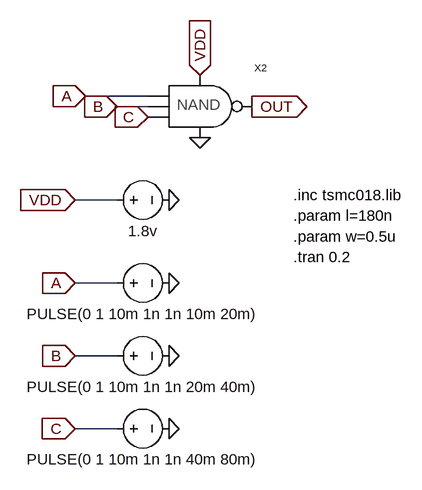
[diagram p0: schematic NAND3sim.asc]
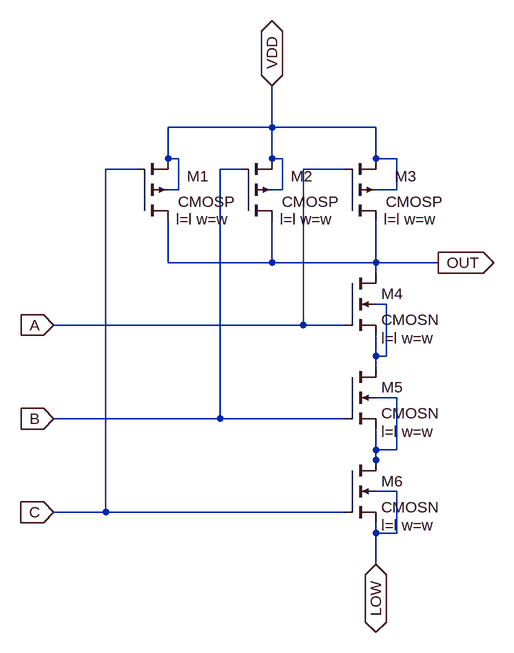
[diagram p1: sub-circuit nand3.asc]
NAND3sim.asc, the LTspice schematic file:
Version 4
SHEET 1 880 712
WIRE 112 128 16 128
WIRE 112 144 64 144
WIRE 64 288 0 288
WIRE 64 416 0 416
WIRE 64 528 0 528
WIRE 64 640 0 640
FLAG 16 128 A
IOPIN 16 128 In
FLAG 64 144 B
IOPIN 64 144 In
FLAG 112 160 C
IOPIN 112 160 In
FLAG 192 96 VDD
IOPIN 192 96 In
FLAG 272 144 OUT
IOPIN 272 144 Out
FLAG 192 192 0
FLAG 144 288 0
FLAG 144 416 0
FLAG 144 528 0
FLAG 144 640 0
FLAG 0 288 VDD
IOPIN 0 288 In
FLAG 0 416 A
IOPIN 0 416 In
FLAG 0 528 B
IOPIN 0 528 In
FLAG 0 640 C
IOPIN 0 640 In
SYMBOL voltage 48 288 R270
WINDOW 0 32 56 Invisible 2
WINDOW 3 -32 56 VBottom 2
SYMATTR InstName V1
SYMATTR Value 1.8v
SYMBOL voltage 48 416 R270
WINDOW 0 32 56 Invisible 2
WINDOW 3 -32 56 VBottom 2
WINDOW 123 0 0 Left 0
WINDOW 39 0 0 Left 0
SYMATTR InstName V2
SYMATTR Value PULSE(0 1 10m 1n 1n 10m 20m)
SYMBOL voltage 48 528 R270
WINDOW 0 32 56 Invisible 2
WINDOW 3 -32 56 VBottom 2
WINDOW 123 0 0 Left 0
WINDOW 39 0 0 Left 0
SYMATTR InstName V3
SYMATTR Value PULSE(0 1 10m 1n 1n 20m 40m)
SYMBOL voltage 48 640 R270
WINDOW 0 32 56 Invisible 2
WINDOW 3 -32 56 VBottom 2
WINDOW 123 0 0 Left 0
WINDOW 39 0 0 Left 0
SYMATTR InstName V4
SYMATTR Value PULSE(0 1 10m 1n 1n 40m 80m)
SYMBOL NAND3 192 368 R0
SYMATTR InstName X2
TEXT 336 280 Left 2 !.inc tsmc018.lib
TEXT 336 312 Left 2 !.param l=180n
TEXT 336 344 Left 2 !.param w=0.5u
TEXT 336 376 Left 2 !.tran 0.2

nand3.asc, the sub-circuit schematic file:
Version 4
SHEET 1 1216 840
WIRE 352 -48 352 -112
WIRE 352 -48 192 -48
WIRE 512 -48 352 -48
WIRE 192 0 192 -48
WIRE 208 0 192 0
WIRE 352 0 352 -48
WIRE 368 0 352 0
WIRE 512 0 512 -48
WIRE 544 0 512 0
WIRE 144 16 96 16
WIRE 304 16 272 16
WIRE 464 16 400 16
WIRE 208 48 208 0
WIRE 208 48 192 48
WIRE 368 48 368 0
WIRE 368 48 352 48
WIRE 544 48 544 0
WIRE 544 48 512 48
WIRE 192 160 192 96
WIRE 352 160 352 96
WIRE 352 160 192 160
WIRE 512 160 512 96
WIRE 512 160 352 160
WIRE 608 160 512 160
WIRE 512 176 512 160
WIRE 528 224 512 224
WIRE 400 256 400 16
WIRE 400 256 16 256
WIRE 464 256 400 256
WIRE 512 304 512 272
WIRE 528 304 528 224
WIRE 528 304 512 304
WIRE 512 320 512 304
WIRE 544 368 512 368
WIRE 272 400 272 16
WIRE 272 400 16 400
WIRE 464 400 272 400
WIRE 512 448 512 416
WIRE 544 448 544 368
WIRE 544 448 512 448
WIRE 512 464 512 448
WIRE 512 480 512 464
WIRE 544 512 512 512
WIRE 96 544 96 16
WIRE 96 544 16 544
WIRE 464 544 96 544
WIRE 512 576 512 560
WIRE 544 576 544 512
WIRE 544 576 512 576
WIRE 512 624 512 576
FLAG 352 -112 VDD
IOPIN 352 -112 BiDir
FLAG 16 256 A
IOPIN 16 256 In
FLAG 16 400 B
IOPIN 16 400 In
FLAG 16 544 C
IOPIN 16 544 In
FLAG 608 160 OUT
IOPIN 608 160 Out
FLAG 512 624 LOW
IOPIN 512 624 BiDir
SYMBOL nmos4 464 176 R0
WINDOW 123 56 100 Left 2
SYMATTR Value2 l=l w=w
SYMATTR InstName M4
SYMATTR Value CMOSN
SYMBOL nmos4 464 320 R0
WINDOW 123 56 100 Left 2
SYMATTR Value2 l=l w=w
SYMATTR InstName M5
SYMATTR Value CMOSN
SYMBOL nmos4 464 464 R0
WINDOW 123 56 100 Left 2
SYMATTR Value2 l=l w=w
SYMATTR InstName M6
SYMATTR Value CMOSN
SYMBOL pmos4 144 96 M180
WINDOW 123 60 3 Left 2
WINDOW 0 77 69 Left 2
WINDOW 3 63 30 Left 2
SYMATTR Value2 l=l w=w
SYMATTR InstName M1
SYMATTR Value CMOSP
SYMBOL pmos4 464 96 M180
WINDOW 123 60 3 Left 2
WINDOW 0 77 69 Left 2
WINDOW 3 63 30 Left 2
SYMATTR Value2 l=l w=w
SYMATTR InstName M3
SYMATTR Value CMOSP
SYMBOL pmos4 304 96 M180
WINDOW 123 60 3 Left 2
WINDOW 0 77 69 Left 2
WINDOW 3 63 30 Left 2
SYMATTR Value2 l=l w=w
SYMATTR InstName M2
SYMATTR Value CMOSP

The netlist it stands for:
* NAND3sim.asc
V1 VDD 0 1.8v
V2 A 0 PULSE(0 1 10m 1n 1n 10m 20m)
V3 B 0 PULSE(0 1 10m 1n 1n 20m 40m)
V4 C 0 PULSE(0 1 10m 1n 1n 40m 80m)
XX2 VDD A B C 0 OUT nand3

* block symbol definitions
.subckt nand3 VDD A B C LOW OUT
M4 OUT A N001 N001 CMOSN l=l w=w
M5 N001 B N002 N002 CMOSN l=l w=w
M6 N002 C LOW LOW CMOSN l=l w=w
M1 OUT C VDD VDD CMOSP l=l w=w
M3 OUT A VDD VDD CMOSP l=l w=w
M2 OUT B VDD VDD CMOSP l=l w=w
.ends nand3

.model NMOS NMOS
.model PMOS PMOS
.lib standard.mos
.inc tsmc018.lib
.param l=180n
.param w=0.5u
.tran 0.2
.backanno
.end

* Results of the author's LTspice run, read from the files saved beside the schematic
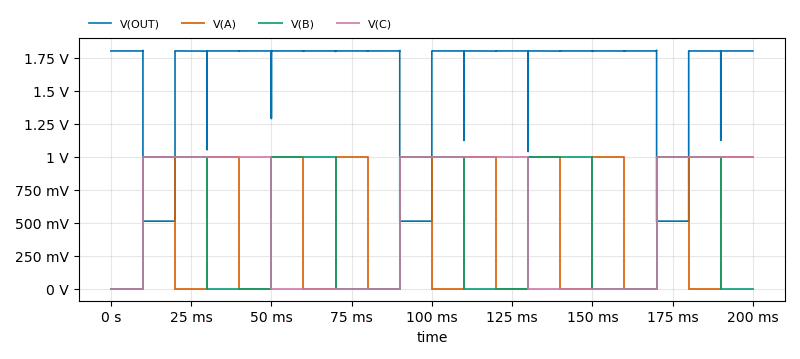
[diagram p2: Transient Analysis of NAND3sim.asc, plotted from the saved traces]
* Transient Analysis, 1 run:
*   V(OUT): min 510.7 mV, max 1.805 V, average 1.607 V, rms 1.671 V, last 1.8 V
*   V(A): min 0 V, max 1 V, average 500 mV, rms 707.1 mV, last 1 V
*   V(B): min 0 V, max 1 V, average 500 mV, rms 707.1 mV, last 0 V
*   V(C): min 0 V, max 1 V, average 550 mV, rms 741.6 mV, last 1 V